# Altium schematic sheet FPGABanks.SchDoc
size 420 x 297 mm; Organization: Altium Limited; Address1: L3, 12a Rodborough Rd; Address2: Frenchs Forest; Address3: NSW; Address4: Australia 2086
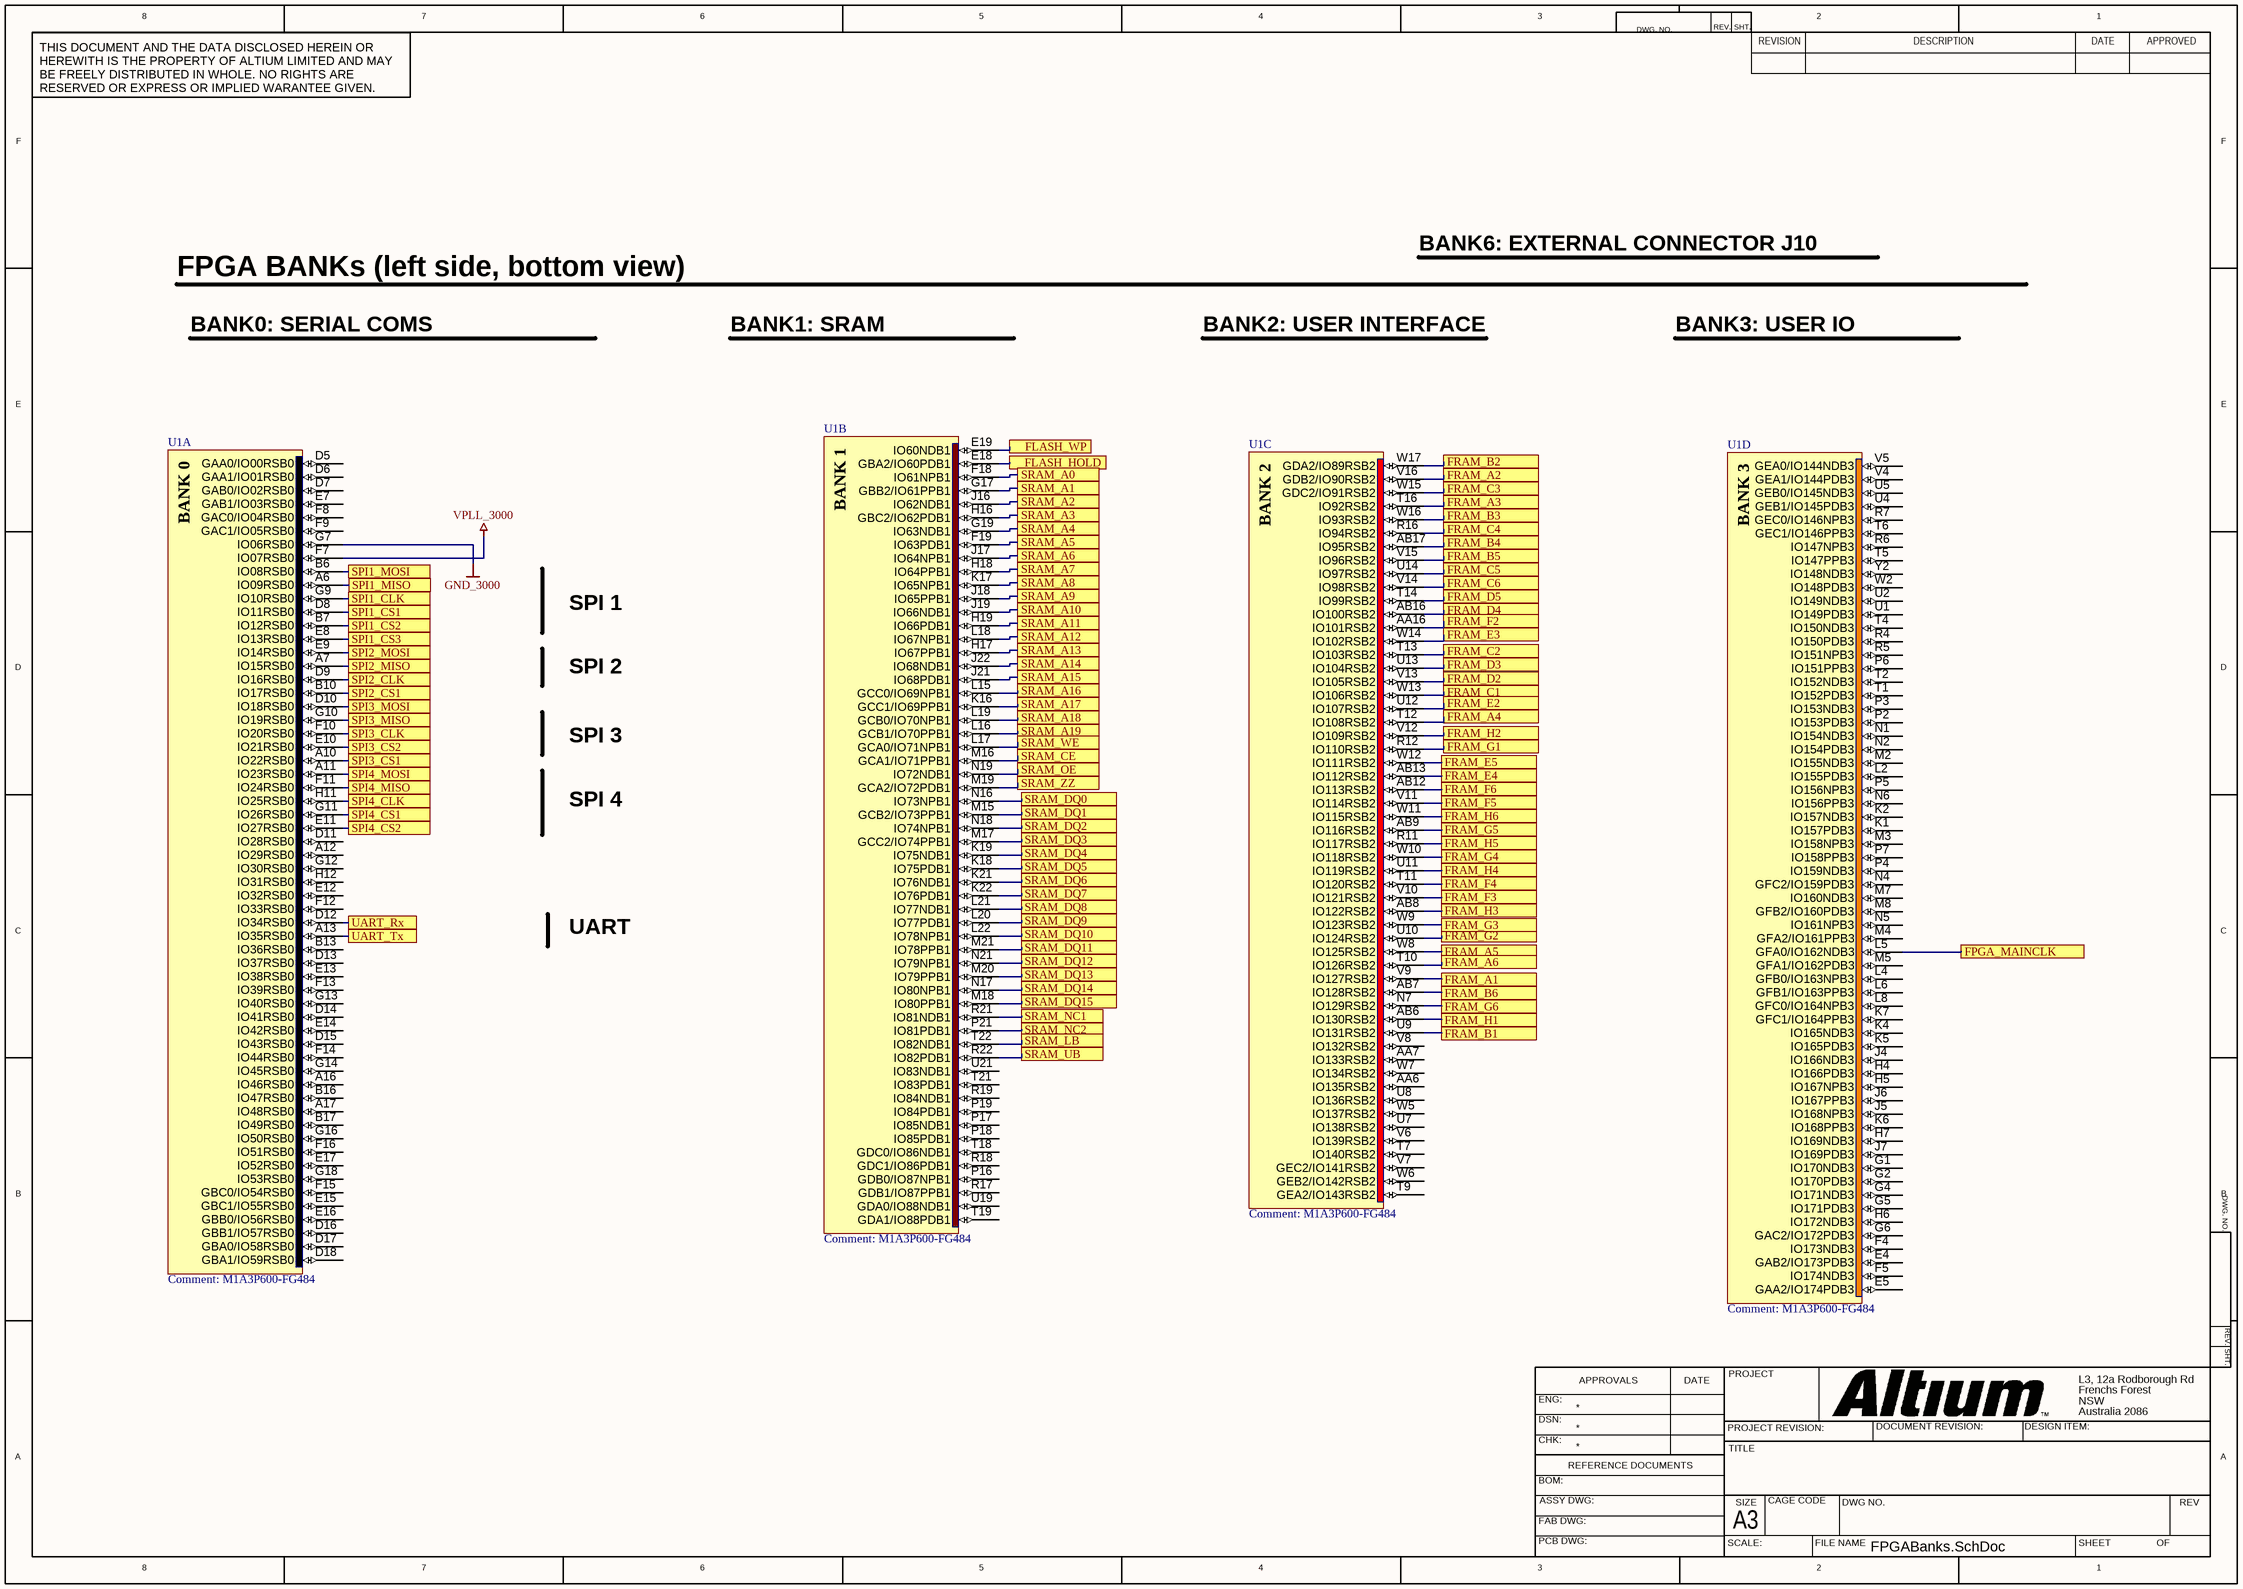
[diagram p0: FPGABanks.SchDoc]

## Parts
U1  M1A3P600-FG484  [FG484]  (parts A,B,C,D of 8)

## Ports
FLASH_HOLD, FLASH_WP, FPGA_MAINCLK, FRAM_A1, FRAM_A2, FRAM_A3, FRAM_A4, FRAM_A5, FRAM_A6, FRAM_B1, FRAM_B2, FRAM_B3, FRAM_B4, FRAM_B5, FRAM_B6, FRAM_C1, FRAM_C2, FRAM_C3, FRAM_C4, FRAM_C5, FRAM_C6, FRAM_D2, FRAM_D3, FRAM_D4, FRAM_D5, FRAM_E2, FRAM_E3, FRAM_E4, FRAM_E5, FRAM_F2, FRAM_F3, FRAM_F4, FRAM_F5, FRAM_F6, FRAM_G1, FRAM_G2, FRAM_G3, FRAM_G4, FRAM_G5, FRAM_G6, FRAM_H1, FRAM_H2, FRAM_H3, FRAM_H4, FRAM_H5, FRAM_H6, SPI1_CLK, SPI1_CS1, SPI1_CS2, SPI1_CS3, SPI1_MISO, SPI1_MOSI, SPI2_CLK, SPI2_CS1, SPI2_MISO, SPI2_MOSI, SPI3_CLK, SPI3_CS1, SPI3_CS2, SPI3_MISO, SPI3_MOSI, SPI4_CLK, SPI4_CS1, SPI4_CS2, SPI4_MISO, SPI4_MOSI, SRAM_A0, SRAM_A1, SRAM_A2, SRAM_A3, SRAM_A4, SRAM_A5, SRAM_A6, SRAM_A7, SRAM_A8, SRAM_A9, SRAM_A10, SRAM_A11, SRAM_A12, SRAM_A13, SRAM_A14, SRAM_A15, SRAM_A16, SRAM_A17, SRAM_A18, SRAM_A19, SRAM_CE, SRAM_DQ0, SRAM_DQ1, SRAM_DQ2, SRAM_DQ3, SRAM_DQ4, SRAM_DQ5, SRAM_DQ6, SRAM_DQ7, SRAM_DQ8, SRAM_DQ9, SRAM_DQ10, SRAM_DQ11, SRAM_DQ12, SRAM_DQ13, SRAM_DQ14, SRAM_DQ15, SRAM_LB, SRAM_NC1, SRAM_NC2, SRAM_OE, SRAM_UB, SRAM_WE, SRAM_ZZ, UART_Rx, UART_Tx

## Nets
GND_3000: U1.G7(IO06RSB0)
VPLL_3000: U1.F7(IO07RSB0)
FLASH_HOLD: U1.E18(GBA2/IO60PDB1) ; port FLASH_HOLD
FLASH_WP: U1.E19(IO60NDB1) ; port FLASH_WP
FPGA_MAINCLK: U1.L5(GFA0/IO162NDB3) ; port FPGA_MAINCLK
FRAM_A1: U1.V9(IO127RSB2) ; port FRAM_A1
FRAM_A2: U1.V16(GDB2/IO90RSB2) ; port FRAM_A2
FRAM_A3: U1.T16(IO92RSB2) ; port FRAM_A3
FRAM_A4: U1.T12(IO108RSB2) ; port FRAM_A4
FRAM_A5: U1.W8(IO125RSB2) ; port FRAM_A5
FRAM_A6: U1.T10(IO126RSB2) ; port FRAM_A6
FRAM_B1: U1.U9(IO131RSB2) ; port FRAM_B1
FRAM_B2: U1.W17(GDA2/IO89RSB2) ; port FRAM_B2
FRAM_B3: U1.W16(IO93RSB2) ; port FRAM_B3
FRAM_B4: U1.AB17(IO95RSB2) ; port FRAM_B4
FRAM_B5: U1.V15(IO96RSB2) ; port FRAM_B5
FRAM_B6: U1.AB7(IO128RSB2) ; port FRAM_B6
FRAM_C1: U1.W13(IO106RSB2) ; port FRAM_C1
FRAM_C2: U1.T13(IO103RSB2) ; port FRAM_C2
FRAM_C3: U1.W15(GDC2/IO91RSB2) ; port FRAM_C3
FRAM_C4: U1.R16(IO94RSB2) ; port FRAM_C4
FRAM_C5: U1.U14(IO97RSB2) ; port FRAM_C5
FRAM_C6: U1.V14(IO98RSB2) ; port FRAM_C6
FRAM_D2: U1.V13(IO105RSB2) ; port FRAM_D2
FRAM_D3: U1.U13(IO104RSB2) ; port FRAM_D3
FRAM_D4: U1.AB16(IO100RSB2) ; port FRAM_D4
FRAM_D5: U1.T14(IO99RSB2) ; port FRAM_D5
FRAM_E2: U1.U12(IO107RSB2) ; port FRAM_E2
FRAM_E3: U1.W14(IO102RSB2) ; port FRAM_E3
FRAM_E4: U1.AB13(IO112RSB2) ; port FRAM_E4
FRAM_E5: U1.W12(IO111RSB2) ; port FRAM_E5
FRAM_F2: U1.AA16(IO101RSB2) ; port FRAM_F2
FRAM_F3: U1.V10(IO121RSB2) ; port FRAM_F3
FRAM_F4: U1.T11(IO120RSB2) ; port FRAM_F4
FRAM_F5: U1.V11(IO114RSB2) ; port FRAM_F5
FRAM_F6: U1.AB12(IO113RSB2) ; port FRAM_F6
FRAM_G1: U1.R12(IO110RSB2) ; port FRAM_G1
FRAM_G2: U1.U10(IO124RSB2) ; port FRAM_G2
FRAM_G3: U1.W9(IO123RSB2) ; port FRAM_G3
FRAM_G4: U1.W10(IO118RSB2) ; port FRAM_G4
FRAM_G5: U1.AB9(IO116RSB2) ; port FRAM_G5
FRAM_G6: U1.N7(IO129RSB2) ; port FRAM_G6
FRAM_H1: U1.AB6(IO130RSB2) ; port FRAM_H1
FRAM_H2: U1.V12(IO109RSB2) ; port FRAM_H2
FRAM_H3: U1.AB8(IO122RSB2) ; port FRAM_H3
FRAM_H4: U1.U11(IO119RSB2) ; port FRAM_H4
FRAM_H5: U1.R11(IO117RSB2) ; port FRAM_H5
FRAM_H6: U1.W11(IO115RSB2) ; port FRAM_H6
SPI1_CLK: U1.G9(IO10RSB0) ; port SPI1_CLK
SPI1_CS1: U1.D8(IO11RSB0) ; port SPI1_CS1
SPI1_CS2: U1.B7(IO12RSB0) ; port SPI1_CS2
SPI1_CS3: U1.E8(IO13RSB0) ; port SPI1_CS3
SPI1_MISO: U1.A6(IO09RSB0) ; port SPI1_MISO
SPI1_MOSI: U1.B6(IO08RSB0) ; port SPI1_MOSI
SPI2_CLK: U1.D9(IO16RSB0) ; port SPI2_CLK
SPI2_CS1: U1.B10(IO17RSB0) ; port SPI2_CS1
SPI2_MISO: U1.A7(IO15RSB0) ; port SPI2_MISO
SPI2_MOSI: U1.E9(IO14RSB0) ; port SPI2_MOSI
SPI3_CLK: U1.F10(IO20RSB0) ; port SPI3_CLK
SPI3_CS1: U1.A10(IO22RSB0) ; port SPI3_CS1
SPI3_CS2: U1.E10(IO21RSB0) ; port SPI3_CS2
SPI3_MISO: U1.G10(IO19RSB0) ; port SPI3_MISO
SPI3_MOSI: U1.D10(IO18RSB0) ; port SPI3_MOSI
SPI4_CLK: U1.H11(IO25RSB0) ; port SPI4_CLK
SPI4_CS1: U1.G11(IO26RSB0) ; port SPI4_CS1
SPI4_CS2: U1.E11(IO27RSB0) ; port SPI4_CS2
SPI4_MISO: U1.F11(IO24RSB0) ; port SPI4_MISO
SPI4_MOSI: U1.A11(IO23RSB0) ; port SPI4_MOSI
SRAM_A0: U1.F18(IO61NPB1) ; port SRAM_A0
SRAM_A1: U1.G17(GBB2/IO61PPB1) ; port SRAM_A1
SRAM_A2: U1.J16(IO62NDB1) ; port SRAM_A2
SRAM_A3: U1.H16(GBC2/IO62PDB1) ; port SRAM_A3
SRAM_A4: U1.G19(IO63NDB1) ; port SRAM_A4
SRAM_A5: U1.F19(IO63PDB1) ; port SRAM_A5
SRAM_A6: U1.J17(IO64NPB1) ; port SRAM_A6
SRAM_A7: U1.H18(IO64PPB1) ; port SRAM_A7
SRAM_A8: U1.K17(IO65NPB1) ; port SRAM_A8
SRAM_A9: U1.J18(IO65PPB1) ; port SRAM_A9
SRAM_A10: U1.J19(IO66NDB1) ; port SRAM_A10
SRAM_A11: U1.H19(IO66PDB1) ; port SRAM_A11
SRAM_A12: U1.L18(IO67NPB1) ; port SRAM_A12
SRAM_A13: U1.H17(IO67PPB1) ; port SRAM_A13
SRAM_A14: U1.J22(IO68NDB1) ; port SRAM_A14
SRAM_A15: U1.J21(IO68PDB1) ; port SRAM_A15
SRAM_A16: U1.L15(GCC0/IO69NPB1) ; port SRAM_A16
SRAM_A17: U1.K16(GCC1/IO69PPB1) ; port SRAM_A17
SRAM_A18: U1.L19(GCB0/IO70NPB1) ; port SRAM_A18
SRAM_A19: U1.L16(GCB1/IO70PPB1) ; port SRAM_A19
SRAM_CE: U1.M16(GCA1/IO71PPB1) ; port SRAM_CE
SRAM_DQ0: U1.N16(IO73NPB1) ; port SRAM_DQ0
SRAM_DQ1: U1.M15(GCB2/IO73PPB1) ; port SRAM_DQ1
SRAM_DQ2: U1.N18(IO74NPB1) ; port SRAM_DQ2
SRAM_DQ3: U1.M17(GCC2/IO74PPB1) ; port SRAM_DQ3
SRAM_DQ4: U1.K19(IO75NDB1) ; port SRAM_DQ4
SRAM_DQ5: U1.K18(IO75PDB1) ; port SRAM_DQ5
SRAM_DQ6: U1.K21(IO76NDB1) ; port SRAM_DQ6
SRAM_DQ7: U1.K22(IO76PDB1) ; port SRAM_DQ7
SRAM_DQ8: U1.L21(IO77NDB1) ; port SRAM_DQ8
SRAM_DQ9: U1.L20(IO77PDB1) ; port SRAM_DQ9
SRAM_DQ10: U1.L22(IO78NPB1) ; port SRAM_DQ10
SRAM_DQ11: U1.M21(IO78PPB1) ; port SRAM_DQ11
SRAM_DQ12: U1.N21(IO79NPB1) ; port SRAM_DQ12
SRAM_DQ13: U1.M20(IO79PPB1) ; port SRAM_DQ13
SRAM_DQ14: U1.N17(IO80NPB1) ; port SRAM_DQ14
SRAM_DQ15: U1.M18(IO80PPB1) ; port SRAM_DQ15
SRAM_LB: U1.T22(IO82NDB1) ; port SRAM_LB
SRAM_NC1: U1.R21(IO81NDB1) ; port SRAM_NC1
SRAM_NC2: U1.P21(IO81PDB1) ; port SRAM_NC2
SRAM_OE: U1.N19(IO72NDB1) ; port SRAM_OE
SRAM_UB: U1.R22(IO82PDB1) ; port SRAM_UB
SRAM_WE: U1.L17(GCA0/IO71NPB1) ; port SRAM_WE
SRAM_ZZ: U1.M19(GCA2/IO72PDB1) ; port SRAM_ZZ
UART_Rx: U1.D12(IO34RSB0) ; port UART_Rx
UART_Tx: U1.A13(IO35RSB0) ; port UART_Tx

Not connected (* = marked no-connect by the designer): U1 A12(IO29RSB0) A16(IO46RSB0) A17(IO48RSB0) AA6(IO135RSB2) AA7(IO133RSB2) B13(IO36RSB0) B16(IO47RSB0) B17(IO49RSB0) D5(GAA0/IO00RSB0) D6(GAA1/IO01RSB0) D7(GAB0/IO02RSB0) D11(IO28RSB0) D13(IO37RSB0) D14(IO41RSB0) D15(IO43RSB0) D16(GBB1/IO57RSB0) D17(GBA0/IO58RSB0) D18(GBA1/IO59RSB0) E4(GAB2/IO173PDB3) E5(GAA2/IO174PDB3) E7(GAB1/IO03RSB0) E12(IO32RSB0) E13(IO38RSB0) E14(IO42RSB0) E15(GBC1/IO55RSB0) E16(GBB0/IO56RSB0) E17(IO52RSB0) F4(IO173NDB3) F5(IO174NDB3) F8(GAC0/IO04RSB0) F9(GAC1/IO05RSB0) F12(IO33RSB0) F13(IO39RSB0) F14(IO44RSB0) F15(GBC0/IO54RSB0) F16(IO51RSB0) G1(IO170NDB3) G2(IO170PDB3) G4(IO171NDB3) G5(IO171PDB3) G6(GAC2/IO172PDB3) G12(IO30RSB0) G13(IO40RSB0) G14(IO45RSB0) G16(IO50RSB0) G18(IO53RSB0) H4(IO166PDB3) H5(IO167NPB3) H6(IO172NDB3) H7(IO169NDB3) H12(IO31RSB0) J4(IO166NDB3) J5(IO168NPB3) J6(IO167PPB3) J7(IO169PDB3) K1(IO157PDB3) K2(IO157NDB3) K4(IO165NDB3) K5(IO165PDB3) K6(IO168PPB3) K7(GFC1/IO164PPB3) L2(IO155PDB3) L4(GFB0/IO163NPB3) L6(GFB1/IO163PPB3) L8(GFC0/IO164NPB3) M2(IO155NDB3) M3(IO158NPB3) M4(GFA2/IO161PPB3) M5(GFA1/IO162PDB3) M7(IO160NDB3) M8(GFB2/IO160PDB3) N1(IO154NDB3) N2(IO154PDB3) N4(GFC2/IO159PDB3) N5(IO161NPB3) N6(IO156PPB3) P2(IO153PDB3) P3(IO153NDB3) P4(IO159NDB3) P5(IO156NPB3) P6(IO151PPB3) P7(IO158PPB3) P16(GDB0/IO87NPB1) P17(IO85NDB1) P18(IO85PDB1) P19(IO84PDB1) R4(IO150PDB3) R5(IO151NPB3) R6(IO147NPB3) R7(GEC0/IO146NPB3) R17(GDB1/IO87PPB1) R18(GDC1/IO86PDB1) R19(IO84NDB1) T1(IO152PDB3) T2(IO152NDB3) T4(IO150NDB3) T5(IO147PPB3) T6(GEC1/IO146PPB3) T7(IO140RSB2) T9(GEA2/IO143RSB2) T18(GDC0/IO86NDB1) T19(GDA1/IO88PDB1) T21(IO83PDB1) U1(IO149PDB3) U2(IO149NDB3) U4(GEB1/IO145PDB3) U5(GEB0/IO145NDB3) U7(IO138RSB2) U8(IO136RSB2) U19(GDA0/IO88NDB1) U21(IO83NDB1) V4(GEA1/IO144PDB3) V5(GEA0/IO144NDB3) V6(IO139RSB2) V7(GEC2/IO141RSB2) V8(IO132RSB2) W2(IO148PDB3) W5(IO137RSB2) W6(GEB2/IO142RSB2) W7(IO134RSB2) Y2(IO148NDB3)

## Notes on the sheet
- BANK6: EXTERNAL CONNECTOR J10
- FPGA BANKs (left side, bottom view)
- BANK0: SERIAL COMS
- BANK1: SRAM
- BANK2: USER INTERFACE
- BANK3: USER IO
- SPI 1
- SPI 2
- SPI 3
- SPI 4
- UART
- 8
- 7
- 6
- 5
- 4
- 3
- DWG. NO.
- REV.
- SHT.
- REVISION
- 2
- DESCRIPTION
- DATE
- 1
- APPROVED
- THIS DOCUMENT AND THE DATA DISCLOSED HEREIN OR HEREWITH IS THE PROPERTY OF ALTIUM LIMITED AND MAY BE FREELY DISTRIBUTED IN WHOLE. NO RIGHTS ARE RESERVED OR EXPRESS OR IMPLIED WARANTEE GIVEN.
- F
- E
- D
- C
- B
- ENG:
- APPROVALS
- PROJECT
- A
- DSN:
- CHK:
- REFERENCE DOCUMENTS
- PROJECT REVISION:
- TITLE
- DOCUMENT REVISION:
- DESIGN ITEM:
- BOM:
- FAB DWG:
- PCB DWG:
- ASSY DWG:
- SCALE:
- A3
- SIZE
- CAGE CODE
- FILE NAME
- DWG NO.
- SHEET
- OF
- REV
- (in symbol CMP-0097-00007-1, part A) BANK 0
- (in symbol CMP-0097-00007-1, part B) BANK 1
- (in symbol CMP-0097-00007-1, part C) BANK 2
- (in symbol CMP-0097-00007-1, part D) BANK 3

## Library data of the parts
U1 = CMP-0097-00007-1: M1-Ready ProASIC3 Flash Family FPGA, 235 User IOs, 600K System Gates, 108 Kbits RAM, 1 Kbit Flash ROM, 1 PLL, 484-Ball FBGA, Commercial Grade; Code_JEDEC: MS-034-AAJ-1; PackageDescription: 484-Ball Fine Pitch Plastic Ball Grid Array (FG484) - Fully Populated; DatasheetVersion: v1.3, Oct-2009; PackageReference: FG484; PackageVersion: ver11.2, Nov-2009; Code_IPC: BGA100P22X22-484